# EAGLE design CellMonitorAndControl (EAGLE 6.3)
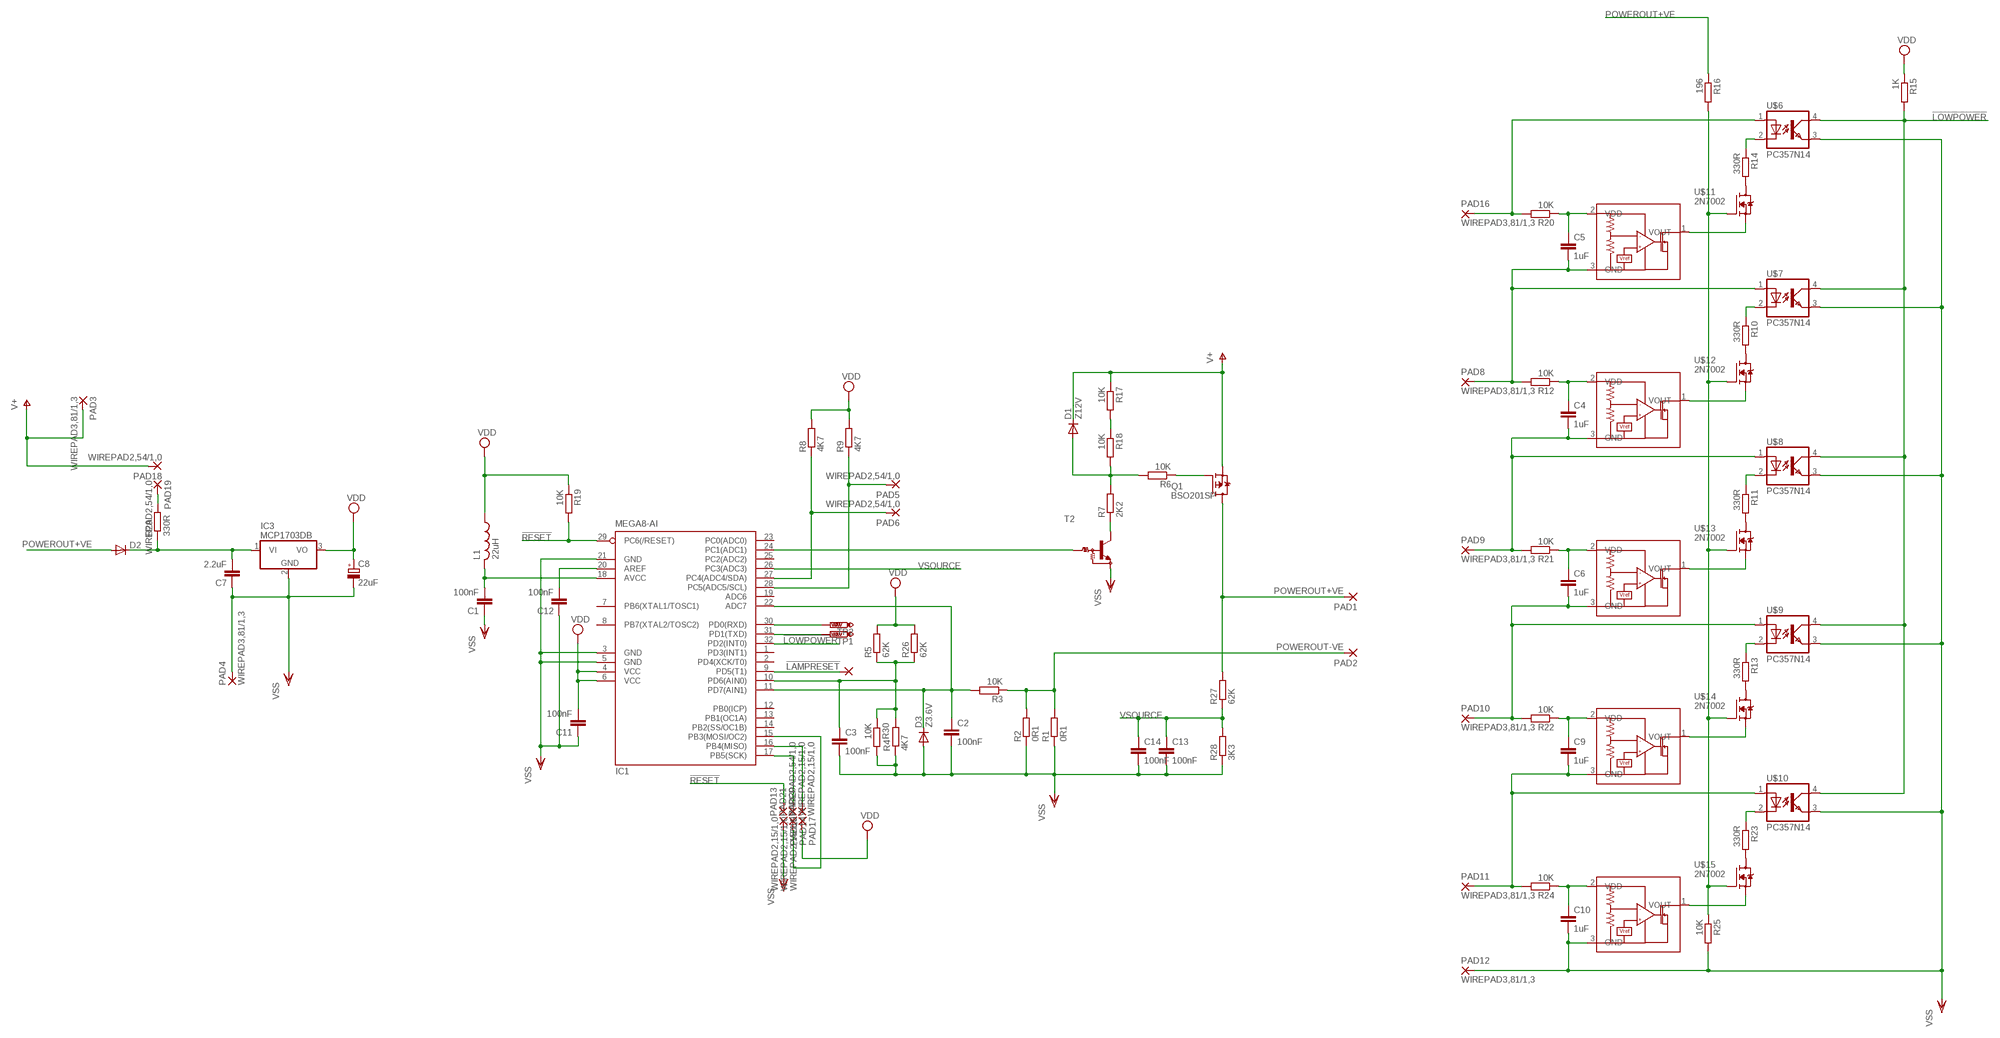
[diagram p0: schematic, sheet 1]

## Parts
C1  100nF  C-EUC1206  [C1206]
C2  100nF  C-EUC1206  [C1206]
C3  100nF  C-EUC1206  [C1206]
C4  1uF  C-EUC1206  [C1206]
C5  1uF  C-EUC1206  [C1206]
C6  1uF  C-EUC1206  [C1206]
C7  2.2uF  C-EUC1206  [C1206]
C8  22uF  CPOL-EUB/3528-21R  [B/3528-21R]
C9  1uF  C-EUC1206  [C1206]
C10  1uF  C-EUC1206  [C1206]
C11  100nF  C-EUC1206  [C1206]
C12  100nF  C-EUC1206  [C1206]
C13  100nF  C-EUC1206  [C1206]
C14  100nF  C-EUC1206  [C1206]
D1  Z12V  DIODE-SOD323-W  [SOD323-W]
D2  DIODE-SOD123  [SOD123]
D3  Z3.6V  DIODE-SOD323-R  [SOD323-R]
IC1  MEGA8-AI  [TQFP32-08]
IC3  MCP1703DB  [SOT223]
L1  22uH  L-US  [ELL6SH]
PAD1  WIREPAD3,81/1,3  [3,81/1,3]
PAD2  WIREPAD3,81/1,3  [3,81/1,3]
PAD3  WIREPAD3,81/1,3  [3,81/1,3]
PAD4  WIREPAD3,81/1,3  [3,81/1,3]
PAD5  WIREPAD2,54/1,0  [2,54/1,0]
PAD6  WIREPAD2,54/1,0  [2,54/1,0]
PAD7  WIREPAD2,54/1,0  [2,54/1,0]
PAD8  WIREPAD3,81/1,3  [3,81/1,3]
PAD9  WIREPAD3,81/1,3  [3,81/1,3]
PAD10  WIREPAD3,81/1,3  [3,81/1,3]
PAD11  WIREPAD3,81/1,3  [3,81/1,3]
PAD12  WIREPAD3,81/1,3  [3,81/1,3]
PAD13  WIREPAD2,54/1,0  [2,54/1,0]
PAD14  WIREPAD2,15/1,0  [2,15/1,0]
PAD15  WIREPAD2,15/1,0  [2,15/1,0]
PAD16  WIREPAD3,81/1,3  [3,81/1,3]
PAD17  WIREPAD2,15/1,0  [2,15/1,0]
PAD18  WIREPAD2,54/1,0  [2,54/1,0]
PAD19  WIREPAD2,54/1,0  [2,54/1,0]
PAD20  WIREPAD2,15/1,0  [2,15/1,0]
PAD21  WIREPAD2,15/1,0  [2,15/1,0]
Q1  BSO201SP  [SO-8]
R1  0R1  R-EU_R2512  [R2512]
R2  0R1  R-EU_R2512  [R2512]
R3  10K  R-EU_R0805  [R0805]
R4  4K7  R-EU_R0402  [R0402]
R5  62K  R-EU_R0402  [R0402]
R6  10K  R-EU_R0805  [R0805]
R7  2K2  R-EU_R0402  [R0402]
R8  4K7  R-EU_R0402  [R0402]
R9  4K7  R-EU_R0402  [R0402]
R10  330R  R-EU_R0402  [R0402]
R11  330R  R-EU_R0402  [R0402]
R12  10K  R-EU_R0805  [R0805]
R13  330R  R-EU_R0402  [R0402]
R14  330R  R-EU_R0402  [R0402]
R15  1K  R-EU_R0402  [R0402]
R16  196  R-EU_R0805  [R0805]
R17  10K  R-EU_R0805  [R0805]
R18  10K  R-EU_R0805  [R0805]
R19  10K  R-EU_R0805  [R0805]
R20  10K  R-EU_R0805  [R0805]
R21  10K  R-EU_R0805  [R0805]
R22  10K  R-EU_R0805  [R0805]
R23  330R  R-EU_R0402  [R0402]
R24  10K  R-EU_R0805  [R0805]
R25  10K  R-EU_R0805  [R0805]
R26  62K  R-EU_R0402  [R0402]
R27  62K  R-EU_R0402  [R0402]
R28  3K3  R-EU_R0603  [R0603]
R29  330R  R-EU_R0402  [R0402]
R30  10K  R-EU_R0805  [R0805]
T2  -NPN_DRIVER-  [SOT23]
TP1  PTR1B1,27  [B1,27]
TP2  PTR1B1,27  [B1,27]
U$1  BU48XXG  [SOT95P280X125-5N]
U$2  BU48XXG  [SOT95P280X125-5N]
U$3  BU48XXG  [SOT95P280X125-5N]
U$4  BU48XXG  [SOT95P280X125-5N]
U$5  BU48XXG  [SOT95P280X125-5N]
U$6  PC357N14  [MINI-FLAT-4-DS]
U$7  PC357N14  [MINI-FLAT-4-DS]
U$8  PC357N14  [MINI-FLAT-4-DS]
U$9  PC357N14  [MINI-FLAT-4-DS]
U$10  PC357N14  [MINI-FLAT-4-DS]
U$11  2N7002  [SOT23]
U$12  2N7002  [SOT23]
U$13  2N7002  [SOT23]
U$14  2N7002  [SOT23]
U$15  2N7002  [SOT23]

## Nets
!LAMPRESET: IC1.9(PD5(T1)) PAD7.1(P)
!LOWPOWER: IC1.32(PD2(INT0)) R15.2 U$6.4(COL) U$7.4(COL) U$8.4(COL) U$9.4(COL) U$10.4(COL)
!RESET: IC1.29(PC6(/RESET)) PAD13.1(P) R19.2
N$1: Q1.4(G) R6.1
N$2: R14.2 U$11.3(D)
N$3: C2.1 D3.C IC1.11(PD7(AIN1)) IC1.22(ADC7) R3.2
N$4: D1.A R6.2 R7.2 R18.2
N$5: R10.2 U$12.3(D)
N$6: R7.1 T2.3(C)
N$7: C5.1 R20.1 U$1.2(VDD)
N$8: R17.2 R18.1
N$9: IC1.24(PC1(ADC1)) T2.1(B)
N$10: IC1.27(PC4(ADC4/SDA)) PAD6.1(P) R8.1
N$11: IC1.28(PC5(ADC5/SCL)) PAD5.1(P) R9.1
N$12: R11.2 U$13.3(D)
N$13: U$1.1(VOUT) U$11.2(S)
N$14: R14.1 U$6.2(C)
N$15: C3.1 IC1.10(PD6(AIN0)) R4.2 R5.1 R26.1 R30.1
N$16: C5.2 PAD8.1(P) R12.2 U$1.3(GND) U$7.1(A)
N$17: R13.2 U$14.3(D)
N$18: U$2.1(VOUT) U$12.2(S)
N$19: R10.1 U$7.2(C)
N$20: R23.2 U$15.3(D)
N$21: C4.1 R12.1 U$2.2(VDD)
N$22: C4.2 PAD9.1(P) R21.2 U$2.3(GND) U$8.1(A)
N$23: C1.2 IC1.18(AVCC) L1.2
N$24: C12.2 IC1.20(AREF)
N$25: U$3.1(VOUT) U$13.2(S)
N$26: R11.1 U$8.2(C)
N$27: IC1.16(PB4(MISO)) PAD20.1(P)
N$28: C6.1 R21.1 U$3.2(VDD)
N$29: IC1.17(PB5(SCK)) PAD21.1(P)
N$30: C6.2 PAD10.1(P) R22.2 U$3.3(GND) U$9.1(A)
N$31: IC1.15(PB3(MOSI/OC2)) PAD14.1(P)
N$32: U$4.1(VOUT) U$14.2(S)
N$33: R13.1 U$9.2(C)
N$34: PAD16.1(P) R20.2 U$6.1(A)
N$35: PAD19.1(P) R29.2
N$36: C9.1 R22.1 U$4.2(VDD)
N$37: IC1.30(PD0(RXD)) TP2.TP
N$38: C9.2 PAD11.1(P) R24.2 U$4.3(GND) U$10.1(A)
N$39: IC1.31(PD1(TXD)) TP1.TP
N$40: U$5.1(VOUT) U$15.2(S)
N$41: R23.1 U$10.2(C)
N$43: C10.1 R24.1 U$5.2(VDD)
N$44: R16.2 R25.1 U$11.1(G) U$12.1(G) U$13.1(G) U$14.1(G) U$15.1(G)
POWEROUT+VE: D2.A PAD1.1(P) Q1.5(D) Q1.6(D) Q1.7(D) Q1.8(D) R16.1 R27.2
POWEROUT-VE: PAD2.1(P) R1.2 R2.2 R3.1
V+: D1.C PAD3.1(P) PAD18.1(P) Q1.1(S) Q1.2(S) Q1.3(S) R17.1
VDD: C8.+ C11.2 IC1.4(VCC) IC1.6(VCC) IC3.3(VO) L1.1 PAD17.1(P) R5.2 R8.2 R9.2 R15.1 R19.1 R26.2
VIN: C7.2 D2.C IC3.1(VI) R29.1
VSOURCE: C13.1 C14.1 IC1.26(PC3(ADC3)) R27.1 R28.2
VSS: C1.1 C2.2 C3.2 C7.1 C8.- C10.2 C11.1 C12.1 C13.2 C14.2 D3.A IC1.3(GND) IC1.5(GND) IC1.21(GND) IC3.2(GND) PAD4.1(P) PAD12.1(P) PAD15.1(P) R1.1 R2.1 R4.1 R25.2 R28.1 R30.2 T2.2(E) U$5.3(GND) U$6.3(EMIT) U$7.3(EMIT) U$8.3(EMIT) U$9.3(EMIT) U$10.3(EMIT)
Unconnected: IC1.1(PD3(INT1)) IC1.2(PD4(XCK/T0)) IC1.7(PB6(XTAL1/TOSC1)) IC1.8(PB7(XTAL2/TOSC2)) IC1.12(PB0(ICP)) IC1.13(PB1(OC1A)) IC1.14(PB2(SS/OC1B)) IC1.19(ADC6) IC1.23(PC0(ADC0)) IC1.25(PC2(ADC2))

## Library data of the parts
C1-C7 C9-C14 = rcl:C-EU: CAPACITOR, European symbol
C8 = rcl:CPOL-EU: POLARIZED CAPACITOR, European symbol
D1-D3 = diode:DIODE-: DIODE
IC1 = atmel:MEGA8: MICROCONTROLLER 8 Kbytes FLASH, 1 kbytes SRAM, 512 bytes EEPROM, USART, 6-channel 10 bit ADC, 2-channel 8 bit ADC Pin compatible with Atmega48, ATMega88, ATMega168 Source: avr.lbr; MPN: ATMEGA8-16AU; OC_FARNELL: 9171371; OC_NEWARK: 73M8863
IC3 = linear:MCP1703: 250 mA, 16V, Low Quiescent Current LDO Regulator Source: http://ww1.microchip.com/downloads/en/DeviceDoc/22049b.pdf
L1 = rcl:L-US: INDUCTOR, American symbol
PAD1-PAD21 = wirepad:WIREPAD: Wire PAD connect wire on PCB
Q1 = transistor-fet:BSO201SP: OptiMOS(R)-P Small-Signal-Transistor P-Channel, Enhancement mode, Super Logic Level (2.5 V rated) RDS(on) 8mOhm, ID -14.9 a Source: http://www.infineon.com/upload/Document/cmc_upload/documents/011/3655/BSO201SP_211201.pdf
R1-R30 = rcl:R-EU_: RESISTOR, European symbol
T2 = transistor:*-NPN_DRIVER-: NPN Bias Resistor Transistor
TP1 TP2 = testpad:PTR1: TEST PIN
U$1-U$5 = ROHM_By_element14_Batch_1:BU48XXG
U$6-U$10 = optocoupler:PC357N14
U$11-U$15 = transistor-fet:2N7002

## Board
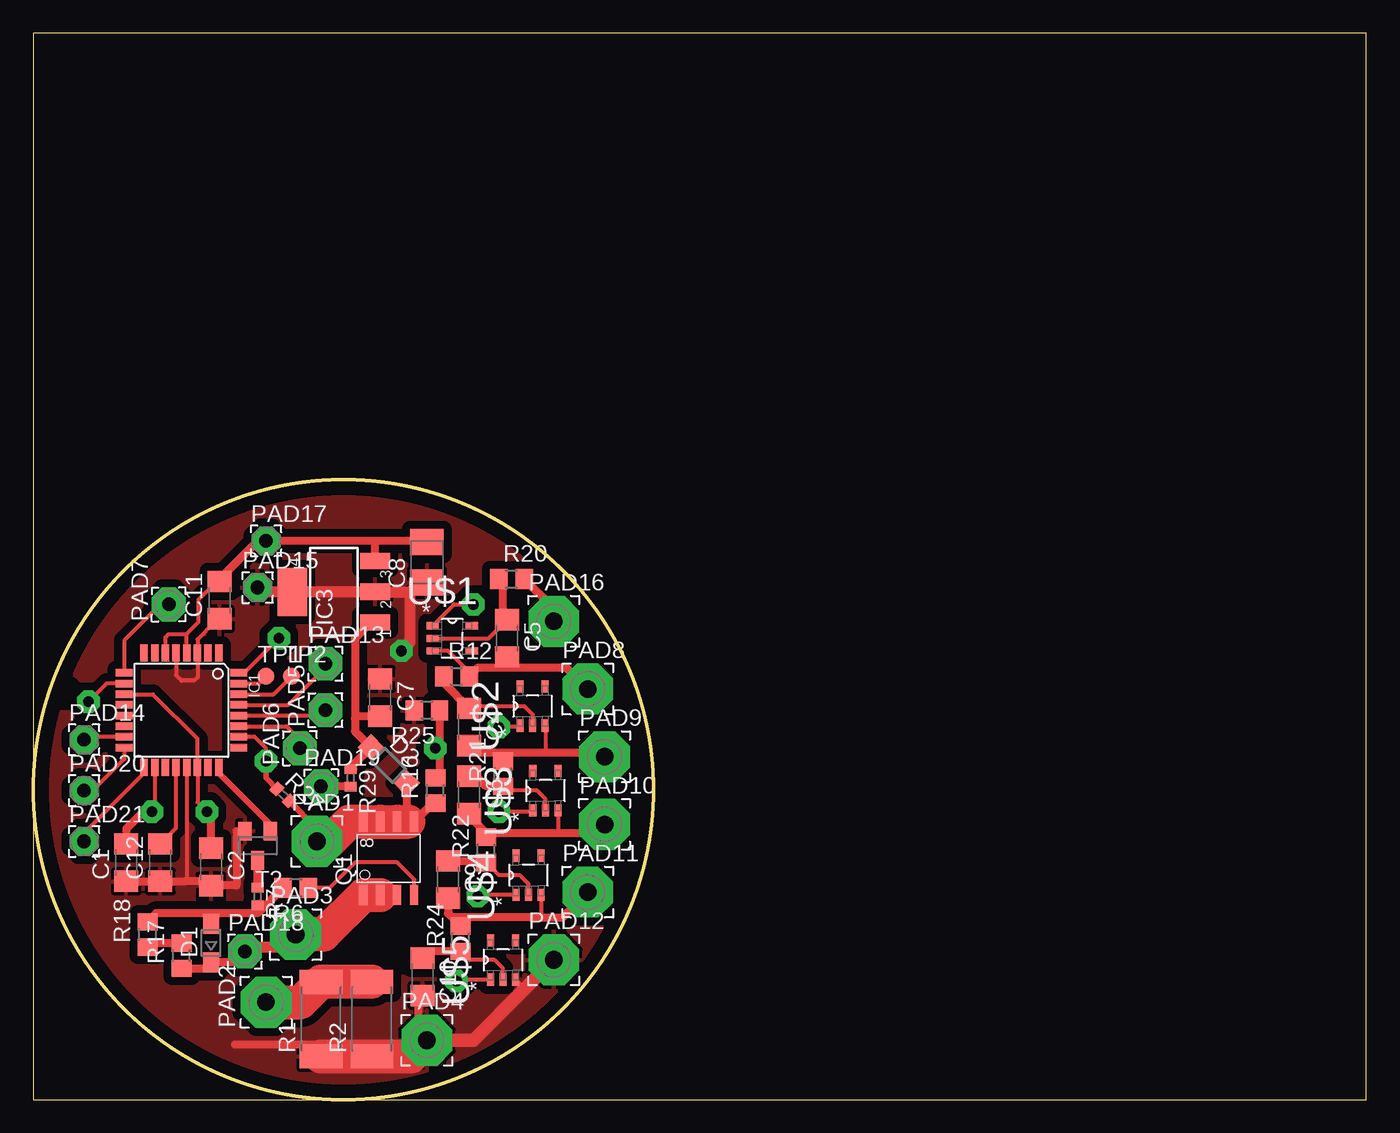
[diagram p1: board, top side]
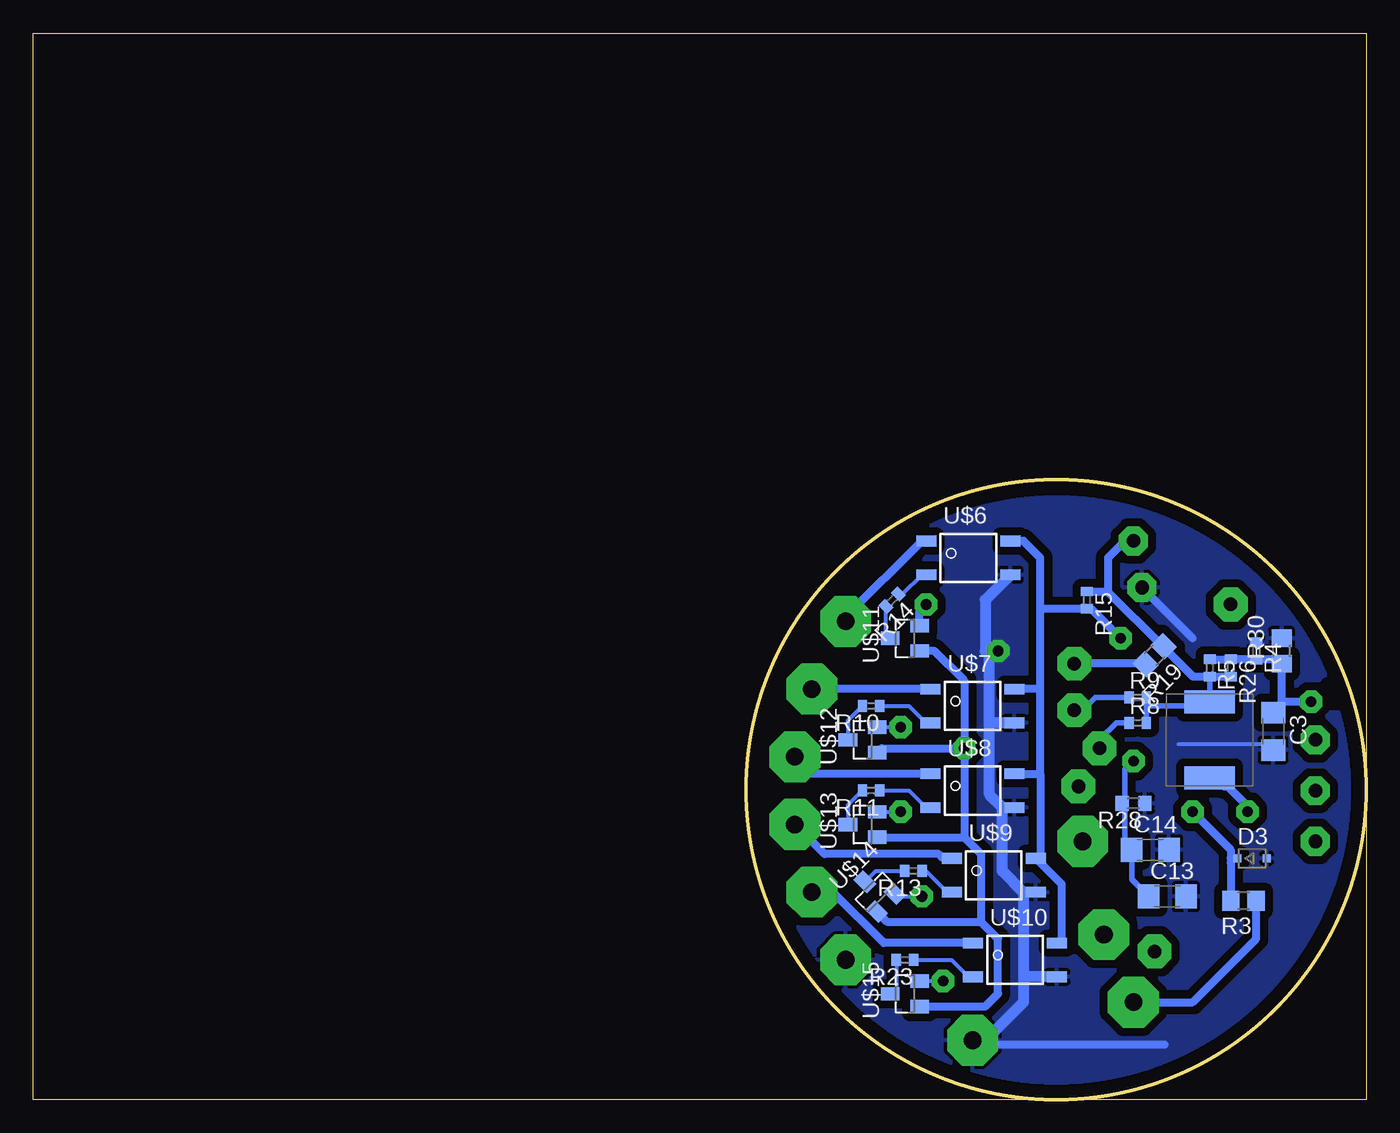
[diagram p2: board, bottom side, seen from below]

Size 100 x 80 mm. Coordinates in mm from the lower left corner, seen from the top.
Outline: 0,0 100,0 100,80 0,80 0,0
Outline: circle at 23.25,23.25 radius 23.25
Copper layers (1*16): Top 0.035mm / dielectric 1.5mm / Bottom 0.035mm
Design rules "default": minimum track width 12mil, minimum drill 24mil, track to track 12.5mil, track to pad 12.5mil, pad to pad 12.5mil, via to via 12.5mil, smd to smd 12.5mil, copper to edge 40mil, drill to drill 8mil, minimum pad ring 10mil, minimum via ring 8mil, stop-mask expansion 4mil, vias tented up to drill 0mil, thermal gap 10mil
tRestrict: area 0,29.8 to 2.9,31.1
bRestrict: area 0,29.8 to 2.9,31.1

### Footprints (pad centres in the part's own frame; a part is rotated, then mirrored left to right if it is on the bottom)
C1206 = smd 1.6 x 1.8: 1 -1.4,0; 2 1.4,0
B/3528-21R = smd 1.95 x 2.5: + 1.525,0; - -1.525,0
SOD323-W = smd 1.5 x 1.2: A 1.45,0; C -1.45,0
SOD123 = smd 1.4 x 1.4: A 1.9,0; C -1.9,0
SOD323-R = smd 0.6 x 0.6: A 1.1,0; C -1.1,0
TQFP32-08 = smd 1.27 x 0.559: 1 -4.293,2.8; 2 -4.293,2; 3 -4.293,1.2; 4 -4.293,0.4; 5 -4.293,-0.4; 6 -4.293,-1.2; 7 -4.293,-2; 8 -4.293,-2.8; 17 4.293,-2.8; 18 4.293,-2; 19 4.293,-1.2; 20 4.293,-0.4; 21 4.293,0.4; 22 4.293,1.2; 23 4.293,2; 24 4.293,2.8 | smd 0.559 x 1.27: 9 -2.8,-4.293; 10 -2,-4.293; 11 -1.2,-4.293; 12 -0.4,-4.293; 13 0.4,-4.293; 14 1.2,-4.293; 15 2,-4.293; 16 2.8,-4.293; 25 2.8,4.293; 26 2,4.293; 27 1.2,4.293; 28 0.4,4.293; 29 -0.4,4.293; 30 -1.2,4.293; 31 -2,4.293; 32 -2.8,4.293
SOT223 = smd 1.219 x 2.235: 1 -2.311,-3.099; 2 0,-3.099; 3 2.311,-3.099 | smd 3.6 x 2.2: 4 0,3.099
ELL6SH = smd 1.7 x 3.8: 1 -2.85,0; 2 2.85,0
3,81/1,3 = drill 1.321 pad 3.81 octagon: 1 0,0
2,54/1,0 = drill 1.016 pad 2.54 octagon: 1 0,0
2,15/1,0 = drill 1.016 pad 2.159 octagon: 1 0,0
SO-8 = smd 1.524 x 0.61: 1 -2.743,1.905; 2 -2.743,0.635; 3 -2.743,-0.635; 4 -2.743,-1.905; 5 2.743,-1.905; 6 2.743,-0.635; 7 2.743,0.635; 8 2.743,1.905
R2512 = smd 1.8 x 3.2: 1 -2.8,0; 2 2.8,0
R0805 = smd 1.3 x 1.5: 1 -0.95,0; 2 0.95,0
R0402 = smd 0.7 x 0.9: 1 -0.65,0; 2 0.65,0
R0603 = smd 1 x 1.1: 1 -0.85,0; 2 0.85,0
SOT23 = smd 1 x 1.4: 1 -0.95,-1.1; 2 0.95,-1.1; 3 0,1.1
B1,27 = smd 1.27 x 1.27: TP 0,0
SOT95P280X125-5N = smd 0.914 x 0.533: 1 -1.473,0.94; 2 -1.473,0; 3 -1.473,-0.94; 4 1.473,-0.94; 5 1.473,0.94
MINI-FLAT-4-DS = smd 1.5 x 0.8: 1 -3.15,1.27; 2 -3.15,-1.27; 3 3.15,-1.27; 4 3.15,1.27

### Placement (x,y rotation side)
C1  6.99,17.78 90 top
C2  13.34,17.46 270 top
C3  6.99,27.62 270 bottom
C4  32.7,27.94 270 top
C5  35.56,34.61 270 top
C6  32.7,22.86 270 top
C7  26.04,30.16 270 top
C8  29.53,40.32 90 top
C9  31.11,16.51 270 top
C10  29.21,9.21 270 top
C11  13.97,37.47 90 top
C12  9.53,17.78 90 top
C13  14.92,15.24 0 bottom
C14  16.19,18.73 0 bottom
D1  13.34,11.75 90 top
D2  26.67,25.08 315 top
D3  8.57,18.1 0 bottom
IC1  11.11,29.21 270 top
IC3  22.54,38.1 90 top
L1  11.75,26.99 270 bottom
PAD1  21.27,19.37 0 top
PAD2  17.46,7.3 90 top
PAD3  19.68,12.38 0 top
PAD4  29.53,4.45 0 top
PAD5  21.91,29.21 90 top
PAD6  20,26.35 90 top
PAD7  10.16,37.15 90 top
PAD8  41.59,30.8 0 top
PAD9  42.86,25.72 0 top
PAD10  42.86,20.64 0 top
PAD11  41.59,15.56 0 top
PAD12  39.05,10.48 0 top
PAD13  21.91,32.7 0 top
PAD14  3.81,26.99 0 top
PAD15  16.83,38.42 0 top
PAD16  39.05,35.88 0 top
PAD17  17.46,41.91 0 top
PAD18  15.88,11.11 0 top
PAD19  21.59,23.5 0 top
PAD20  3.81,23.18 0 top
PAD21  3.81,19.37 0 top
Q1  26.67,18.1 90 top
R1  21.59,6.03 90 top
R2  25.4,6.03 90 top
R3  9.21,14.92 180 bottom
R4  8.26,33.66 270 bottom
R5  11.75,32.38 270 bottom
R6  19.68,15.88 180 top
R7  16.83,15.24 270 top
R8  17.14,28.26 0 bottom
R9  17.14,30.16 0 bottom
R10  37.15,29.53 180 bottom
R11  37.15,23.18 180 bottom
R12  31.75,31.75 0 top
R13  33.97,17.14 180 bottom
R14  35.56,37.47 225 bottom
R15  20.95,37.47 270 bottom
R16  30.16,23.18 90 top
R17  11.11,10.79 90 top
R18  8.57,12.38 90 top
R19  15.88,33.34 225 bottom
R20  35.88,39.05 0 top
R21  35.24,24.45 90 top
R22  33.97,18.73 90 top
R23  34.61,10.48 180 bottom
R24  32.07,12.06 90 top
R25  29.53,29.21 180 top
R26  10.16,32.38 270 bottom
R27  18.73,22.86 315 top
R28  17.46,22.23 180 bottom
R29  23.81,24.13 270 top
R30  6.35,33.66 90 bottom
T2  16.83,19.05 180 top
TP1  17.46,31.75 0 top
TP2  19.37,31.75 0 top
U$1  31.43,34.61 0 top
U$2  37.47,29.53 90 top
U$3  38.42,23.18 90 top
U$4  37.15,16.83 90 top
U$5  35.24,10.48 90 top
U$6  29.84,40.64 0 bottom
U$7  29.53,29.53 0 bottom
U$8  29.53,23.18 0 bottom
U$9  27.94,16.83 0 bottom
U$10  26.35,10.48 0 bottom
U$11  34.61,34.61 90 bottom
U$12  37.78,26.99 90 bottom
U$13  37.78,20.64 90 bottom
U$14  36.83,15.56 45 bottom
U$15  34.61,7.94 90 bottom

### Tracks (layer width: path | path; a pad name or v marks a point on that pad's centre or on a via)
!LAMPRESET
  Top 0.305: PAD7.1 9.53,37.15 6.82,34.44 IC1.9
!LOWPOWER  (via drill 0.8 pad 1.68)
  Top 0.305: IC1.32 15.82,32.01 v18.41,34.61
  Bottom 0.61: U$8.4 24.45,24.45 | U$10.4 22.86,11.75 22.86,16.17 U$9.4 24.45,18.1 24.45,24.45 | 24.45,30.8 U$7.4 | 24.45,24.45 24.45,30.8 | 24.45,30.8 24.45,36.83 | 24.45,36.83 24.45,40.64 25.72,41.91 U$6.4 | v18.41,34.61 20.62,36.81 R15.2 24.43,36.81 24.45,36.83
!RESET
  Top 0.305: IC1.29 19.13,29.61 21.91,32.38 PAD13.1
  Bottom 0.61: R19.2 16.55,32.7 PAD13.1
N$1
  Top 0.305: Q1.4 28.57,16.51 27.3,17.78 24.13,17.78 22.54,16.19 22.22,15.88 R6.1
N$2
  Bottom 0.305: U$11.3 36.02,34.92 R14.2
N$3  (via drill 0.8 pad 1.68)
  Top 0.305: v13.02,21.59 12.31,22.3 IC1.22 12.31,27.06 8.96,30.41 IC1.11
  Top 0.61: C2.1 13.34,21.27 v13.02,21.59
  Bottom 0.61: v13.02,21.59 10.16,18.73 10.16,18.1 | R3.2 10.16,17.78 10.16,18.1 | D3.C 10.16,18.1
N$4
  Top 0.61: R6.2 16.83,13.97 16.51,13.97 | R7.2 16.83,14.29 16.51,13.97 | 16.51,13.97 13.34,13.97 | 13.34,13.97 9.21,13.97 R18.2 | D1.A 13.34,13.97
N$5
  Bottom 0.305: R10.2 38.88,28.44 U$12.3
N$6
  Top 0.61: R7.1 T2.3
N$7
  Top 0.305: U$1.2 34.16,34.61 C5.1
  Top 0.61: C5.1 35.24,36.33 35.24,38.74 R20.1
N$8
  Top 0.61: R18.1 8.88,11.74 R17.2
N$9
  Top 0.406: IC1.24 13.91,24.5 17.78,20.64 T2.1
N$10
  Top 0.305: IC1.27 19,28.01 20,27 PAD6.1
  Bottom 0.406: R8.1 18.75,28.26 20,27 PAD6.1
N$11
  Top 0.305: IC1.28 21.51,28.81 PAD5.1
  Bottom 0.406: R9.1 20.32,30.16 21.27,29.21 PAD5.1
N$12
  Bottom 0.305: R11.2 38.88,22.09 U$13.3
N$13  (via drill 0.8 pad 1.68)
  Top 0.305: U$1.1 31.56,37.15 v33.02,37.15
  Bottom 0.61: U$11.2 33.51,36.66 v33.02,37.15
N$14
  Bottom 0.305: U$6.2 33.34,39.37 34.78,37.92 R14.1
N$15  (via drill 0.8 pad 1.68)
  Top 0.305: IC1.10 5.49,31.21 v4.13,29.84
  Bottom 0.61: R5.1 R26.1 | R26.1 10.13,33.01 | C3.1 6.35,29.02 6.35,29.84 | 6.35,29.84 R30.1 6.65,33.01 R4.2 8.29,33.03 R26.1 | v4.13,29.84 6.35,29.84
N$16
  Top 0.305: R12.2 32.7,32.07 31.1,33.67 U$1.3
  Top 0.61: PAD8.1 40.01,32.38 35.56,32.38 | 35.56,32.38 33.34,32.38 R12.2 | C5.2 35.56,32.38
  Bottom 0.61: U$7.1 PAD8.1
N$17
  Bottom 0.305: U$14.3 36.8,17.14 R13.2
N$18  (via drill 0.8 pad 1.68)
  Top 0.305: U$2.1 36.41,27.94 v34.92,27.94
  Bottom 0.305: U$12.2 v34.92,27.94
N$19
  Bottom 0.305: R10.1 34.29,29.53 33.02,28.26 U$7.2
N$20
  Bottom 0.305: R23.2 35.26,7.94 U$15.3
N$21
  Top 0.305: C4.1 32.89,29.53 36.83,29.53 37.47,28.89 U$2.2
  Top 0.61: R12.1 30.8,31.24 C4.1
N$22
  Top 0.305: U$2.3 38.42,28.04 38.42,26.04
  Top 0.61: C4.2 33.21,26.04 35.24,26.04 | R21.2 35.24,26.04 | 35.24,26.04 38.42,26.04 42.55,26.04 PAD9.1
  Bottom 0.61: U$8.1 41.59,24.45 PAD9.1
N$23  (via drill 0.8 pad 1.68)
  Top 0.305: IC1.18 9.11,21.81 v8.89,21.59
  Top 0.61: v8.89,21.59 8.26,21.59 6.99,20.32 C1.2
  Bottom 0.305: L1.2 10.71,23.5
  Bottom 0.61: 10.71,23.5 10.39,23.5 8.89,22 v8.89,21.59
N$24
  Top 0.305: C12.2 10.71,20.37 IC1.20
N$25  (via drill 0.8 pad 1.68)
  Top 0.305: U$3.1 37.36,21.59 v34.92,21.59
  Bottom 0.305: U$13.2 v34.92,21.59
N$26
  Bottom 0.305: R11.1 34.29,23.18 33.02,21.91 U$8.2
N$27
  Top 0.305: IC1.16 6.82,25.55 4.45,23.18 PAD20.1
N$28
  Top 0.305: U$3.2 38.42,22.54 37.78,23.18 35.56,23.18 R21.1
  Top 0.61: R21.1 33.97,23.5 33.21,24.26 C6.1
N$29
  Top 0.305: IC1.17 8.31,24.5 3.81,20 PAD21.1
N$30
  Top 0.305: U$3.3 39.36,20.02 39.37,20
  Top 0.61: R22.2 34.29,20 39.37,20 42.23,20 PAD10.1 | R22.2 | C6.2 32.7,21.27 33.97,20 R22.2
  Bottom 0.61: PAD10.1 40.64,18.41 32.07,18.41 31.75,18.1 U$9.1
N$31
  Top 0.305: IC1.15 4.03,27.21 PAD14.1
N$32  (via drill 0.8 pad 1.68)
  Top 0.305: U$4.1 33.45,15.35 v33.34,15.24
  Bottom 0.305: U$14.2 35.17,15.24 v33.34,15.24
N$33
  Bottom 0.305: U$9.2 31.43,15.56 33.02,17.14 R13.1
N$34
  Top 0.61: PAD16.1 39.05,36.83 R20.2
  Bottom 0.61: U$6.1 33.34,41.91 39.05,36.2 PAD16.1
N$35
  Top 0.61: R29.2 21.61,23.48 PAD19.1
N$36
  Top 0.305: U$4.2 37.15,16.19 36.51,16.83 34.93,16.83 R22.1
  Top 0.61: C9.1 33.84,17.91 R22.1
N$37
  Top 0.305: IC1.30 18.03,30.41 TP2.TP
N$38
  Top 0.305: U$4.3 38.09,13.66 38.1,13.65
  Top 0.61: PAD11.1 39.69,13.65 38.1,13.65 31.75,13.65 | C9.2 31.11,13.97 31.43,13.65 31.75,13.65 | R24.2 32.07,13.34 31.75,13.65
  Bottom 0.61: U$10.1 36.2,11.75 40.01,15.56 PAD11.1
N$39
  Top 0.305: IC1.31 16.92,31.21 TP1.TP
N$40  (via drill 0.8 pad 1.68)
  Top 0.305: v31.75,8.89 31.86,9 U$5.1
  Bottom 0.305: U$15.2 v31.75,8.89
N$41
  Bottom 0.305: R23.1 31.11,10.48 29.84,9.21 U$10.2
N$43
  Top 0.305: U$5.2 35.24,9.84 34.61,10.48 32.7,10.48 R24.1
  Top 0.61: R24.1 29.72,11.12 C10.1
N$44  (via drill 0.8 pad 1.68)
  Top 0.61: R16.2 30.48,24.45 | 30.48,24.13 R16.2 | 30.48,26.35 30.48,24.13 R16.2 | R25.1 30.48,26.35 | 30.48,26.35 v30.16,26.35
  Bottom 0.61: U$15.1 28.57,6.99 27.62,7.94 27.62,12.06 28.89,13.34 | U$11.1 32.38,33.66 30.16,31.44 v30.16,26.35 | U$14.1 35.95,13.34 28.89,13.34 | 28.89,13.34 28.89,18.41 30.16,19.68 | v30.16,26.35 30.16,19.68 | U$13.1 30.16,19.68 | U$12.1 36.37,26.35 v30.16,26.35
POWEROUT+VE
  Top 0.406: R27.2 21.27,20.32 PAD1.1
  Top 0.61: R16.1 29.96,22.23 Q1.5 27.94,20.84 28.01,20.91 D2.A
  Top 2.54: PAD1.1 22.23,19.37 23.7,20.84 Q1.8 Q1.7 Q1.6 27.94,20.84 28.14,20.84
POWEROUT-VE
  Top 2.54: R2.2 R1.2 20.06,7.3 PAD2.1
  Bottom 0.61: PAD2.1 13.02,7.3 8.26,12.06 R3.1
V+
  Top 0.61: Q1.2 Q1.3 | R17.1 12.88,9.85 D1.C 15.06,10.3 PAD18.1
  Top 0.813: PAD3.1 19.37,12.38 18.41,11.43 16.19,11.43 PAD18.1
  Top 2.54: Q1.2 Q1.1 21.79,12.38 PAD3.1
VDD
  Top 0.305: IC1.6 9.91,34.68 10.16,34.92 11.51,34.92 | IC1.4 11.51,34.92 | 11.51,34.92 12.38,35.8 12.38,37.47 13.78,38.87 C11.2
  Top 0.61: C8.+ 29.53,41.91 25.64,41.91 | IC3.3 25.64,41.91 | 25.64,41.91 PAD17.1 16.83,41.91 13.97,39.05 C11.2
  Bottom 0.406: R5.2 L1.1 12.06,29.53 16.5,29.53 | R8.2 16.5,29.53 | 16.5,29.53 R9.2
  Bottom 0.61: R26.2 R5.2 13,31.73 15.4,34.13 | 11.75,29.53 L1.1 | 19.37,38.1 19.37,40.64 18.1,41.91 PAD17.1 | 19.37,38.1 15.4,34.13 | 19.37,38.1 20.94,38.1 R15.1 | R19.1 15.2,34.13 15.4,34.13
VIN
  Top 0.61: IC3.1 25.31,35.79 24.13,34.61 24.13,28.57 | R29.1 24,24.78 24,25.1 D2.C 24.13,27.62 24.13,28.57 | C7.2 24.32,28.76 24.13,28.57
VSOURCE  (via drill 0.8 pad 1.68)
  Top 0.305: v17.46,25.4 17.46,26.35 16.61,27.21 IC1.26
  Top 0.406: v17.46,25.4 17.46,24.13 R27.1
  Bottom 0.406: C13.1 17.59,16.51 C14.1 18.1,19.24 18.1,22.23 | 18.1,22.23 18.1,24.77 v17.46,25.4 | R28.2 18.1,22.23
VSS  (via drill 0.8 pad 1.68)
  Top 0.305: IC1.5 10.71,31.83 11.11,31.43 12.06,31.43 12.31,31.68 IC1.3 12.31,34.54 13.52,35.75 13.82,35.75 | IC1.21 11.51,16.46 11.43,16.38
  Top 0.406: U$5.3 36.18,8.9 36.83,8.26
  Top 0.61: 21.33,3.49 R1.1 21.59,4.13 15.11,4.13 | PAD4.1 28.89,5.08 28.89,7.49 C10.2 | 6.67,16.06 C1.1 C12.1 11.43,16.38 13.34,16.38 C2.2 15.24,16.06 15.24,20.15 T2.2
  Top 0.813: 28.26,38.1 IC3.2 17.14,38.1 PAD15.1 | v27.62,33.66 28.26,34.29 28.26,38.1 | 28.26,38.1 28.95,38.8 C8.-
  Top 1.016: PAD12.1 36.83,8.26 33.02,4.45 PAD4.1
  Top 2.54: PAD4.1 28.32,3.23 R2.1 R1.1
  Bottom 0.305: 14.07,26.67 7.62,26.67 7.17,26.22 C3.2
  Bottom 0.61: PAD4.1 29.21,4.13 15.11,4.13 | 13.03,34.62 PAD15.1
  Bottom 0.813: 27.3,21.91 27.3,17.14 25.72,15.56 | 27.3,21.91 U$8.3 | U$9.3 25.72,15.56 | 25.72,15.56 25.72,9.21 | 25.72,9.21 25.72,7.3 28.57,4.45 PAD4.1 | U$10.3 25.72,9.21 | U$6.3 28.57,37.49 28.57,33.66 v27.62,33.66 28.26,33.66 28.26,28.26 | 27.3,21.91 28.26,22.86 28.26,28.26 | U$7.3 28.26,28.26
  pour Bottom (isolate 0.61): 0,0 46.5,0 46.5,46.5 0,46.5
  pour Top (isolate 0.61): 0,0 46.5,0 46.5,46.5 0,46.5